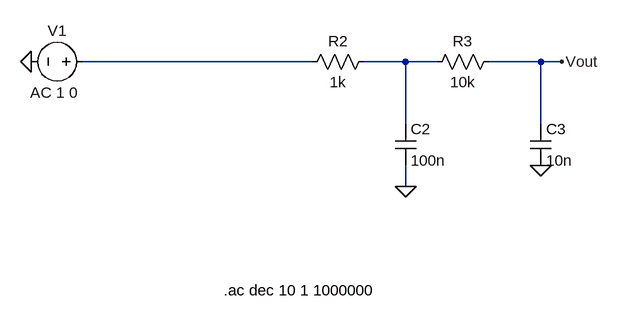
[diagram p0: schematic second_order.asc]
second_order.asc, the LTspice schematic file:
Version 4
SHEET 1 880 680
WIRE 80 16 -272 16
WIRE 224 16 160 16
WIRE 272 16 224 16
WIRE 432 16 352 16
WIRE 464 16 432 16
WIRE 224 112 224 16
WIRE 432 112 432 16
WIRE 224 208 224 176
FLAG -352 16 0
FLAG 224 208 0
FLAG 432 176 0
FLAG 464 16 Vout
SYMBOL voltage -256 16 R90
WINDOW 0 -32 56 VBottom 2
WINDOW 3 32 56 VTop 2
WINDOW 123 63 61 VBottom 2
WINDOW 39 0 0 Left 0
SYMATTR InstName V1
SYMATTR Value ""
SYMATTR Value2 AC 1 0
SYMBOL res 176 0 R90
WINDOW 0 0 56 VBottom 2
WINDOW 3 32 56 VTop 2
SYMATTR InstName R2
SYMATTR Value 1k
SYMBOL res 368 0 R90
WINDOW 0 0 56 VBottom 2
WINDOW 3 32 56 VTop 2
SYMATTR InstName R3
SYMATTR Value 10k
SYMBOL cap 208 112 R0
SYMATTR InstName C2
SYMATTR Value 100n
SYMBOL cap 416 112 R0
SYMATTR InstName C3
SYMATTR Value 10n
TEXT -56 368 Left 2 !.ac dec 10 1 1000000

The netlist it stands for:
* second_order.asc
V1 N001 0 AC 1 0
R2 N002 N001 1k
R3 Vout N002 10k
C2 N002 0 100n
C3 Vout 0 10n
.ac dec 10 1 1000000
.backanno
.end